# EAGLE schematic ecm (EAGLE 9.6.2)
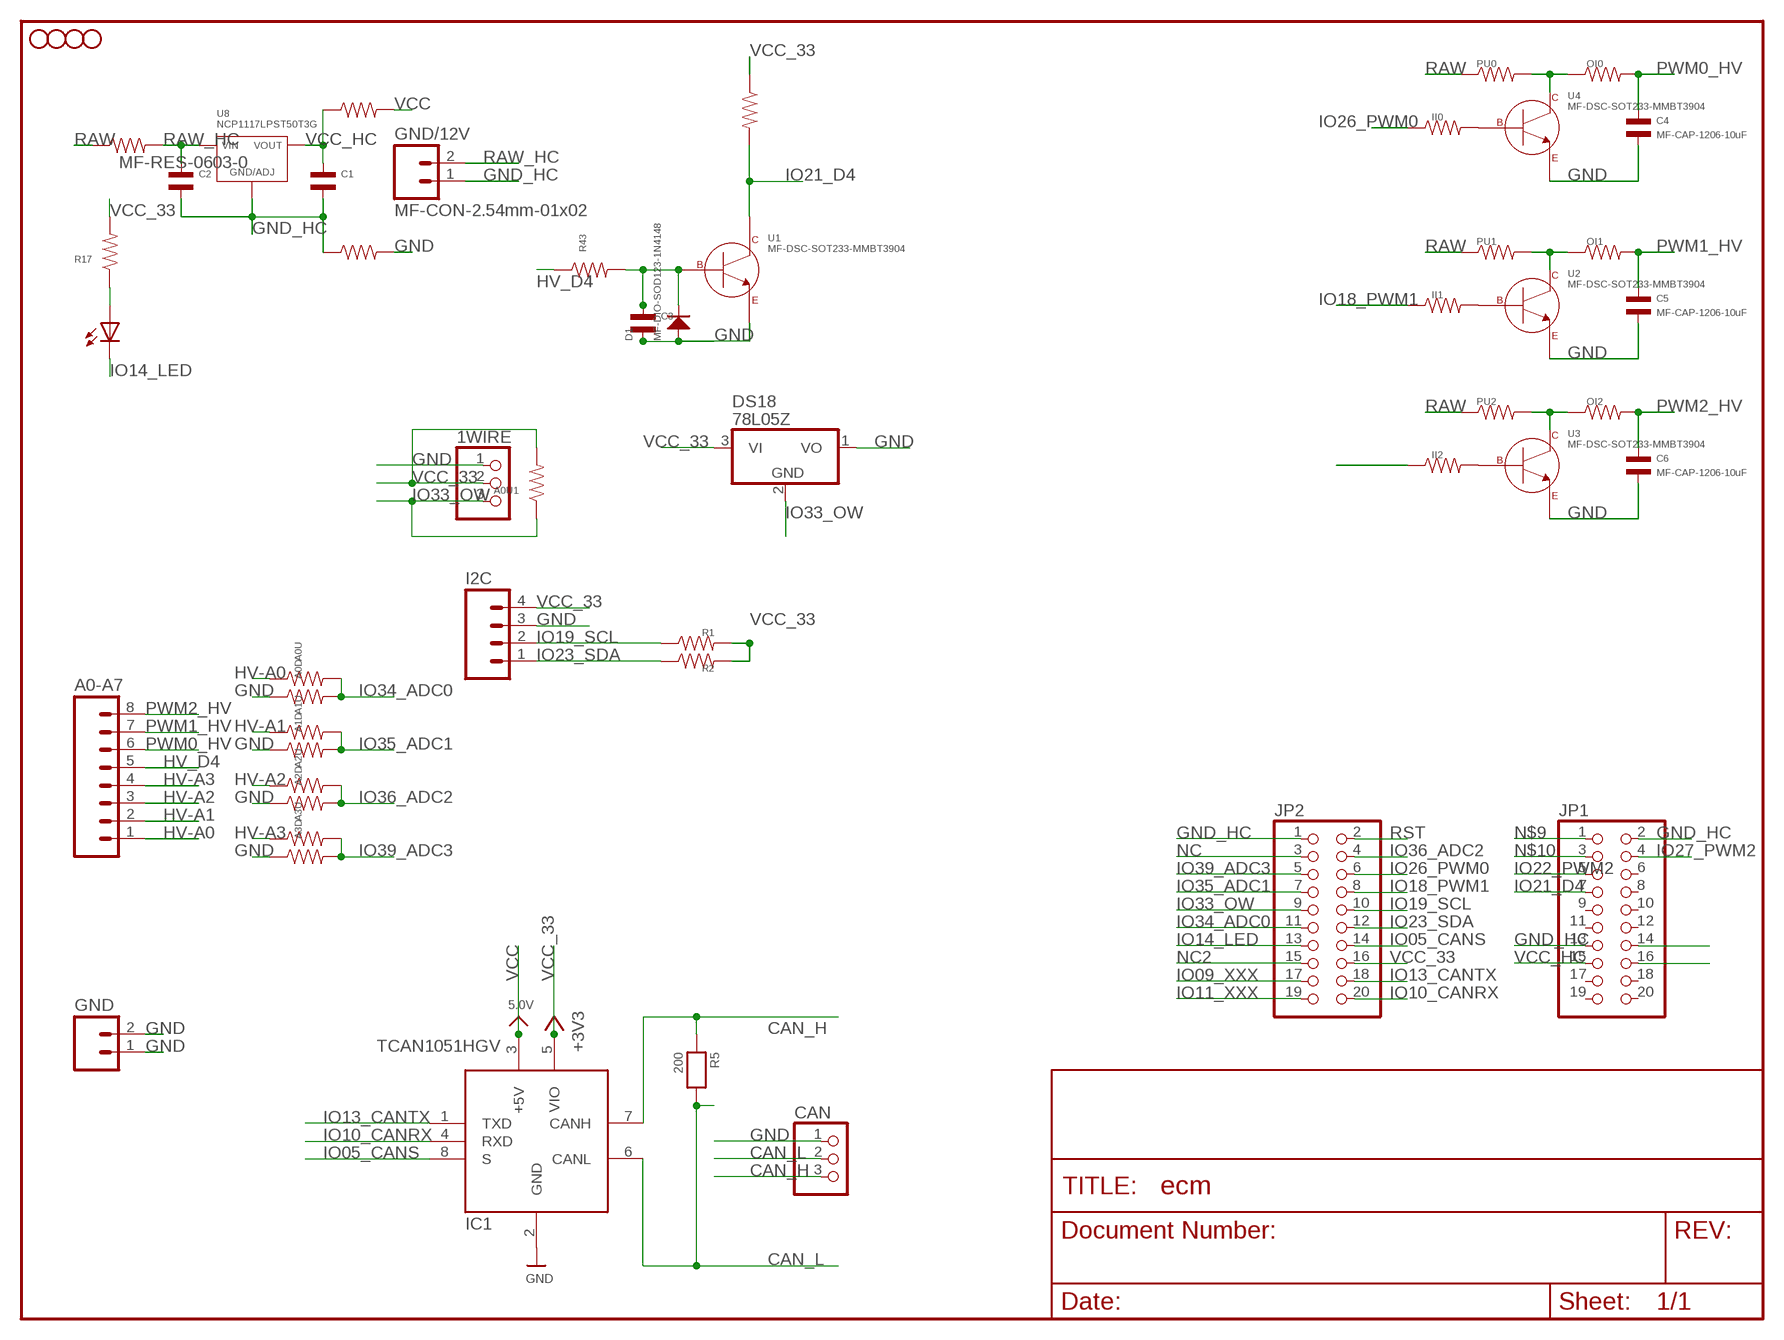
[diagram p0: schematic, sheet 1]

## Parts
1WIRE  1WIRE  PINHD-1X3  [1X03]
A0-A7  MF-CON-2.54mm-01x08  M081X08  [1X08]
A0D  RESISTOR_1206  [R1206]
A0U  RESISTOR_1206  [R1206]
A0U1  RESISTOR_1206  [R1206]
A1D  RESISTOR_1206  [R1206]
A1U  RESISTOR_1206  [R1206]
A2D  RESISTOR_1206  [R1206]
A2U  RESISTOR_1206  [R1206]
A3D  RESISTOR_1206  [R1206]
A3U  RESISTOR_1206  [R1206]
C1  CAPACITOR_NP_1210  [C1210]
C2  CAPACITOR_NP_1210  [C1210]
C3  CAPACITOR_NP_1210  [C1210]
C4  MF-CAP-1206-10uF  CAPACITOR_NP_1206  [C1206]
C5  MF-CAP-1206-10uF  CAPACITOR_NP_1206  [C1206]
C6  MF-CAP-1206-10uF  CAPACITOR_NP_1206  [C1206]
CAN  PINHD-1X3  [1X03]
D1  MF-DIO-SOD123-1N4148  DIODES_1N4148_SOD-123  [SOD-123]
D2  RED  LED-RED1206  [LED-1206]
DS18  78L05Z  [TO92]
GND  MF-CON-2.54mm-01x02  M02PTH  [1X02]
GND/12V  MF-CON-2.54mm-01x02  M02PTH  [1X02]
I2C  PPPC041LFBN-RC  M04PTH  [1X04]
IC1  TCAN1051HGV  CAN_TRANSCIEVER_TCAN1051V  [SOIC8_150MIL]
II0  RESISTOR_1206  [R1206]
II1  RESISTOR_1206  [R1206]
II2  RESISTOR_1206  [R1206]
JP1  HEADER-2X10  [2X10]
JP2  HEADER-2X10  [2X10]
OI0  RESISTOR_1206  [R1206]
OI1  RESISTOR_1206  [R1206]
OI2  RESISTOR_1206  [R1206]
PU0  RESISTOR_1206  [R1206]
PU1  RESISTOR_1206  [R1206]
PU2  RESISTOR_1206  [R1206]
R1  RESISTOR_1206  [R1206]
R2  RESISTOR_1206  [R1206]
R5  200  RESISTOR1206  [1206]
R17  RESISTOR_1206  [R1206]
R43  RESISTOR_1206  [R1206]
R45  RESISTOR_1206  [R1206]
RIN7  MF-RES-0603-0  RESISTOR1206  [1206]
RIN8  MF-RES-0603-0  RESISTOR1206  [1206]
RIN19  MF-RES-0603-0  RESISTOR1206  [1206]
STANDOFF2  STAND-OFF  [STAND-OFF]
STANDOFF3  STAND-OFF  [STAND-OFF]
STANDOFF4  STAND-OFF  [STAND-OFF]
STANDOFF5  STAND-OFF  [STAND-OFF]
U1  MF-DSC-SOT233-MMBT3904  NPN_BJTMMBT3904_SOT-23-3  [SOT-23-3]
U2  MF-DSC-SOT233-MMBT3904  NPN_BJTMMBT3904_SOT-23-3  [SOT-23-3]
U3  MF-DSC-SOT233-MMBT3904  NPN_BJTMMBT3904_SOT-23-3  [SOT-23-3]
U4  MF-DSC-SOT233-MMBT3904  NPN_BJTMMBT3904_SOT-23-3  [SOT-23-3]
U8  NCP1117LPST50T3G  [SOT-223-3]

## Nets
CAN_H: CAN.3 IC1.7(CANH) R5.1
CAN_L: CAN.2 IC1.6(CANL) R5.2
GND: 1WIRE.1 A0D.P$1 A1D.P$1 A2D.P$1 A3D.P$1 C3.P$2 C4.P$2 C5.P$2 C6.P$2 CAN.1 D1.ANODE DS18.1(VO) GND.1 GND.2 I2C.3 IC1.2(GND) RIN8.2 U1.P$2(EMITTER) U2.P$2(EMITTER) U3.P$2(EMITTER) U4.P$2(EMITTER)
GND_HC [hc]: C1.P$2 C2.P$2 GND/12V.1 JP1.2 JP1.13 JP2.1 RIN8.1 U8.P$2(GND/ADJ)
HV-A0: A0-A7.1 A0U.P$1
HV-A1: A0-A7.2 A1U.P$1
HV-A2: A0-A7.3 A2U.P$1
HV-A3: A0-A7.4 A3U.P$1
HV_D4: A0-A7.5 R43.P$1
IO05_CANS: IC1.8(S) JP2.14
IO09_XXX: JP2.17
IO10_CANRX: IC1.4(RXD) JP2.20
IO11_XXX: JP2.19
IO13_CANTX: IC1.1(TXD) JP2.18
IO14_LED: D2.C JP2.13
IO18_PWM1: II1.P$1 JP2.8
IO19_SCL: I2C.2 JP2.10 R1.P$1
IO21_D4: JP1.7 R45.P$2 U1.P$3(COLLECTOR)
IO22_PWM2: II2.P$1 JP1.5
IO23_SDA: I2C.1 JP2.12 R2.P$1
IO26_PWM0: II0.P$1 JP2.6
IO27_PWM2: JP1.4
IO33_OW: 1WIRE.3 A0U1.P$1 DS18.2(GND) JP2.9
IO34_ADC0: A0D.P$2 A0U.P$2 JP2.11
IO35_ADC1: A1D.P$2 A1U.P$2 JP2.7
IO36_ADC2: A2D.P$2 A2U.P$2 JP2.4
IO39_ADC3: A3D.P$2 A3U.P$2 JP2.5
N$1: D2.A R17.P$1
N$2: C3.P$1 D1.CATHODE R43.P$2 U1.P$1(BASE)
N$3: JP1.16
N$4: JP1.14
N$5: OI1.P$1 PU1.P$2 U2.P$3(COLLECTOR)
N$6: II1.P$2 U2.P$1(BASE)
N$7: OI2.P$1 PU2.P$2 U3.P$3(COLLECTOR)
N$8: II2.P$2 U3.P$1(BASE)
N$9: JP1.1
N$10: JP1.3
N$11: OI0.P$1 PU0.P$2 U4.P$3(COLLECTOR)
N$12: II0.P$2 U4.P$1(BASE)
NC: JP2.3
NC2: JP2.15
PWM0_HV: A0-A7.6 C4.P$1 OI0.P$2
PWM1_HV: A0-A7.7 C5.P$1 OI1.P$2
PWM2_HV: A0-A7.8 C6.P$1 OI2.P$2
RAW: PU0.P$1 PU1.P$1 PU2.P$1 RIN19.1
RAW_HC [vcc]: C2.P$1 GND/12V.2 RIN19.2 U8.P$4(VIN)
RST: JP2.2
VCC: IC1.3(+5V) RIN7.2 ; supply symbol labelled 5.0V
VCC_33: 1WIRE.2 A0U1.P$2 DS18.3(VI) I2C.4 IC1.5(VIO) JP2.16 R1.P$2 R2.P$2 R17.P$2 R45.P$1 ; supply symbol labelled +3V3
VCC_HC [hc]: C1.P$1 JP1.15 RIN7.1 U8.P$1(VOUT) U8.P$3(VOUT)
Unconnected: JP1.6 JP1.8 JP1.9 JP1.10 JP1.11 JP1.12 JP1.17 JP1.18 JP1.19 JP1.20

## Library data of the parts
1WIRE CAN = adafruit:PINHD-1X3: PIN HEADER
A0-A7 = SparkFun-Connectors:M08: Header 8 Standard 8-pin 0.1" header. Use with straight break away headers (SKU : PRT-00116), right angle break away headers (PRT-00553), swiss pins (PRT-00743), machine pins (PRT-00117), and female headers (PRT-00115).
A0D A0U A0U1 A1D A1U A2D A2U A3D A3U II0 II1 II2 OI0 OI1 OI2 PU0 PU1 PU2 R1 R2 R17 R43 R45 = MF_Passives:RESISTOR: Library: MF_Passives Description: Device for Resistors. Manufacture part number (MPN), Voltage, Tolerance, and Wattage Rating can be added via Attributes. Check https://factory.macrofab.com/parts for the house parts list.; POPULATE: 1
C1-C6 = MF_Passives:CAPACITOR_NP: Library: MF_Passives Description: Device for Non-Polarized Capacitors. Manufacture part number (MPN) can be added via Attributes. Check https://factory.macrofab.com/parts for the house parts list.; POPULATE: 1
D1 = MF_Discrete_Semiconductor:DIODES: Library: MF_Discrete_Semiconductor Description: Device for Single Packaged Diodes.; HOUSEPART: YES; MPN: MF-DIO-SOD123-1N4148; POPULATE: 1; URL: https://factory.macrofab.com/part/MF-DIO-SOD123-1N4148
D2 = SparkFun-LED:LED-RED: Assorted Red LEDs LilyPad 1206- DIO-09912 1206- DIO-00809 0603- DIO-00819; PROD_ID: DIO-00809
DS18 = adafruit:78*: Positive VOLTAGE REGULATOR Added bigger pads to the TO-92 package
GND GND/12V = SparkFun-Connectors:M02: Standard 2-pin 0.1" header. Use with - straight break away headers ( PRT-00116) - right angle break away headers (PRT-00553) - swiss pins (PRT-00743) - machine pins (PRT-00117) - female headers (PRT-00115) Molex polarized connector foot print use with: PRT-08233 with associated crimp pins and housings. 2.54_SCREWTERM for use with PRT-10571. 3.5mm Screw Terminal footprints for PRT-08084 5mm Screw Terminal footprints for use with PRT-08433
I2C = SparkFun-Connectors:M04: Header 4 Standard 4-pin 0.1" header. Use with straight break away headers (SKU : PRT-00116), right angle break away headers (PRT-00553), swiss pins (PRT-00743), machine pins (PRT-00117), and female headers (PRT-00115). Molex polarized connector foot print use with SKU : PRT-08231 with associated crimp pins and housings. 1MM SMD Version SKU: PRT-10208
IC1 = microbuilder:CAN_TRANSCIEVER
JP1 JP2 = microbuilder:HEADER-2X10: PIN HEADER
R5 = microbuilder:RESISTOR: Resistors 0402 - 0402 Surface Mount Package 22 Ohm 1% 1/16W [Digikey: 311-22.0LRTR-ND] 33 Ohm 5% 1/16W 1.0K 5% 1/16W 1.5K 5% 1/16W 2.0K 1% 1/16W 10.0K 1% 1/16W [Digikey: 311-10.0KLRTR-ND] 10.0K 5% 1/16W [Digikey: RMCF0402JT10K0TR-ND] 12.1K 1% 1/16W [Digikey: 311-22.0LRTR-ND] 100.0K 5% 1/16W 0603 - 0603 Surface Mount Package 0 Ohm 1/10 Watt 1% Resistor 15 Ohm 1/10 Watt 1% Resistor 33 Ohm 1/10 Watt 1% Resistor 49.9 Ohm 1/10 Watt 1% Resistor 100 Ohm 1/10 Watt 1% Resistor 150 Ohm 1/10 Watt 1% Resistor 240 Ohm 1/10 Watt 1% Resistor 390 Ohm 1/10 Watt 1% Resistor 560 Ohm 1/10 Watt 1% Resistor 680 Ohm 1/10 Watt 1% Resistor 750 Ohm 1/10 Watt 1% Resistor 1.0K Ohm 1/10 Watt 1% Resistor 1.5K Ohm 1/10 Watt 1% Resistor 2.0K Ohm 1/10 Watt 1% Resistor 2.2K Ohm 1/10 Watt 1% Resistor 3.3K Ohm 1/10 Watt 1% Resistor 4.7K Ohm 1/10 Watt 1% Resistor 10.0K Ohm 1/10 Watt 1% Resistor 12.0K Ohm 1/10 Watt 1% Resistor 12.1K Ohm 1/10 Watt 1% Resistor 20.0K Ohm 1/10 Watt 1% Resistor 33.0K Ohm 1/10 Watt 1% Resistor 100.0K Ohm 1/10 Watt 1% Resistor 0805 - 0805 Surface Mount Package 0 Ohm 1/8 Watt 1% Resistor 33 Ohm 1/8 Watt 1% Resistor 100 Ohm 1/8 Watt 1% Resistor 150 Ohm 1/8 Watt 1% Resistor 200 Ohm 1/8 Watt 1% Resistor 240 Ohm 1/8 Watt 1% Resistor 330 Ohm 1/8 Watt 1% Resistor 390 Ohm 1/8 Watt 1% Resistor 470 Ohm 1/8 Watt 1% Resistor 1.0K Ohm 1/8 Watt 1% Resistor 1.5K Ohm 1/8 Watt 1% Resistor 2.0K Ohm 1/8 Watt 1% Resistor 4.7K Ohm 1/8 Watt 1% Resistor 5.1K Ohm 1/8 Watt 1% Resistor 5.6K Ohm 1/8 Watt 1% Resistor 10.0K Ohm 1/8 Watt 1% Resistor 22.0K Ohm 1/8 Watt 1% Resistor 33.0K Ohm 1/8 Watt 1% Resistor 100K Ohm 1/8 Watt 1% Resistor 1206 - 1206 Surface Mount Package 2012 - 2010 Surface Mount Package 0.11 Ohm 1/2 Watt 1% Resistor - Digikey: RHM.11UCT-ND
RIN7 RIN8 RIN19 = SparkFun:RESISTOR: Resistor Basic schematic elements and footprints for 0603, 1206, and PTH resistors.
STANDOFF2-STANDOFF5 = SparkFun-Electromechanical:STAND-OFF: #4 Stand Off This is the mechanical footprint for a #4 phillips button head screw. Use the keepout ring to avoid running the screw head into surrounding components. SKU : PRT-00447; POPULATE: 0
U1-U4 = MF_Discrete_Semiconductor:NPN_BJT: Library: MF_Discrete_Semiconductor Description: Device for Single NPN BJT Transistors. Manufacture part number (MFG#) can be added via Attributes.; HOUSEPART: YES; MPN: MF-DSC-SOT233-MMBT3904; POPULATE: 1; URL: https://factory.macrofab.com/part/MF-DSC-SOT233-MMBT3904
U8 = MF_IC_Power:NCP1117LP: Manufacturer Part #: NCP1117LP Manufacturer: ON Semiconductor Description: LDO Voltage Regulators; HOUSEPART: NO; MPN: NCP1117LPST50T3G; POPULATE: 1; URL: http://www.onsemi.com/pub_link/Collateral/NCP1117LP-D.PDF

## Net classes
0 default: width 0.229 mm
1 vcc: width 0.762 mm
2 ground: width 0.762 mm
3 hc: width 0.762 mm